# Altium schematic sheet Differential Pair Setup.SchDoc
size 431 x 279 mm; Organization: ORGANIZATION; Address1: ADDRESS 1; Address2: ADDRESS 2; Address3: ADDRESS 3; Address4: ADDRESS 4; Revision: -; SheetNumber: 1; SheetTotal: 1; ENG_APP_DATE: --/--/--; DSN_APP_DATE: --/--/--; CHK_APP_DATE: --/--/--
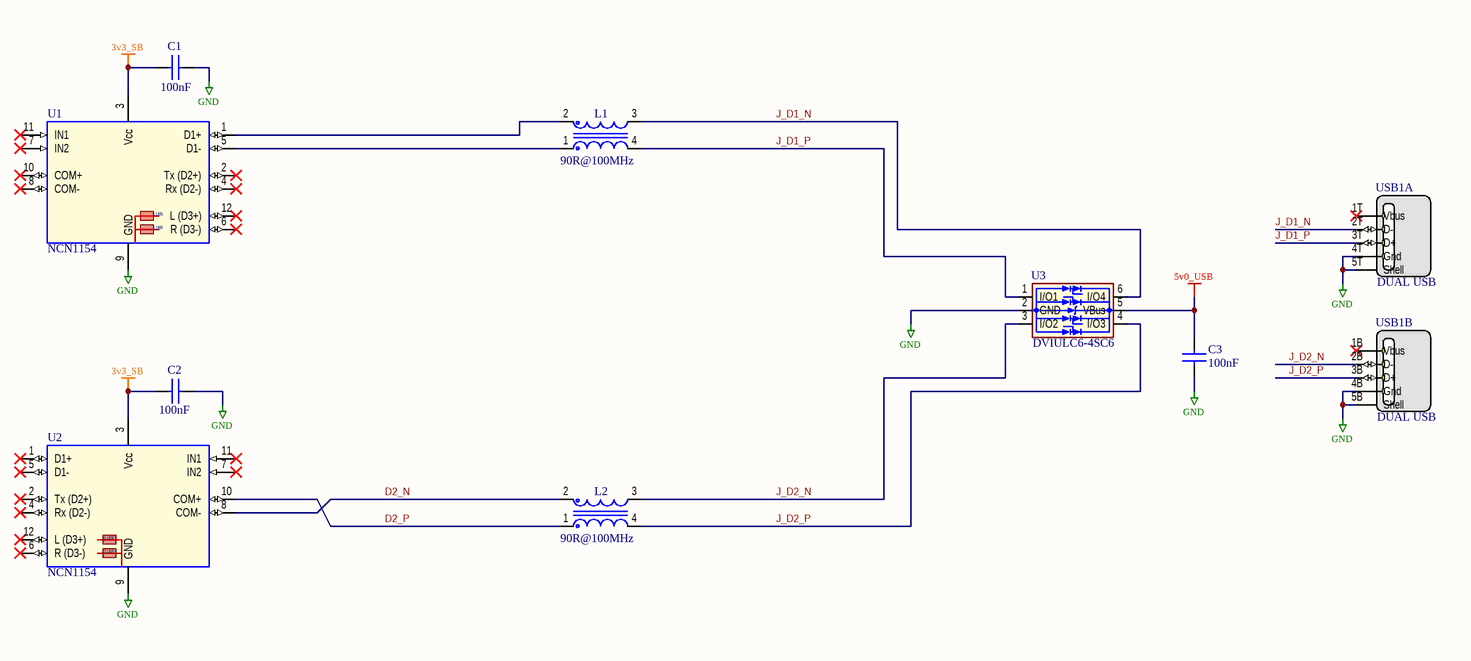
[diagram p0: Differential Pair Setup.SchDoc]

## Parts
C1  100nF  [CC0402]
C2  100nF  [CC0402]
C3  100nF  [CC0402]
L1  90R@100MHz  [ACM2012]
L2  90R@100MHz  [ACM2012]
U1  NCN1154  [UQFN12]
U2  NCN1154  [UQFN12]
U3  DVIULC6-4SC6  [SOT23-6L]
USB1  DUAL USB  [USB-A_RA_DUAL]  (parts A,B of 2)

## Nets
3v3_SB: C1.2 C2.2 U1.3(Vcc) U2.3(Vcc)
5v0_USB: C3.1 U3.5(VBus)
GND: C1.1 C2.1 C3.2 U1.9(GND) U2.9(GND) U3.2(GND) USB1.4B(Gnd) USB1.4T(Gnd) USB1.5B(Shell) USB1.5T(Shell)
D2_N: L2.2 U2.8(COM-)
D2_P: L2.1 U2.10(COM+)
J_D1_N: L1.3 U3.6(I/O4) USB1.2T(D-)
J_D1_P: L1.4 U3.1(I/O1) USB1.3T(D+)
J_D2_N: L2.3 U3.3(I/O2) USB1.2B(D-)
J_D2_P: L2.4 U3.4(I/O3) USB1.3B(D+)
NetL1_1: L1.1 U1.5(D1-)
NetL1_2: L1.2 U1.1(D1+)

Not connected (* = marked no-connect by the designer): U1 2(Tx_(D2+))* 4(Rx_(D2-))* 6(R_(D3-))* 7(IN2)* 8(COM-)* 10(COM+)* 11(IN1)* 12(L_(D3+))*; U2 1(D1+)* 2(Tx_(D2+))* 4(Rx_(D2-))* 5(D1-)* 6(R_(D3-))* 7(IN2)* 11(IN1)* 12(L_(D3+))*; USB1 1B(Vbus)* 1T(Vbus)*

## Notes on the sheet
- 8
- 7
- 6
- 5
- 4
- 3
- DWG. NO.
- REV.
- SHT.
- 2
- 1
- THIS DOCUMENT AND THE DATA DISCLOSED HEREIN OR HEREWITH IS THE PROPERTY OF ALTIUM LIMITED AND MAY BE FREELY DISTRIBUTED IN WHOLE. NO RIGHTS ARE RESERVED OR EXPRESS OR IMPLIED WARANTEE GIVEN.
- REVISION
- DESCRIPTION
- DATE
- APPROVED
- F
- E
- D
- C
- B
- ENG:
- APPROVALS
- PROJECT
- A
- DSN:
- CHK:
- REFERENCE DOCUMENTS
- PROJECT REVISION:
- TITLE
- DOCUMENT REVISION:
- DESIGN ITEM:
- BOM:
- FAB DWG:
- PCB DWG:
- ASSY DWG:
- SCALE:
- SIZE
- CAGE CODE
- FILE NAME
- DWG NO.
- SHEET
- OF
- REV
- (in symbol USB_UART) 118R

## Library data of the parts
C1-C3 = CAP_100nF: Cap, 100nF, X7R, 16V, ±10%, CC0402; Value: 100nF
L1 L2 = FILTER: CMNCK, 90R@100MHz, 50V, 400mA, ACM2012; Value: 90R@100MHz
U1 U2 = USB_UART: 3:1 High-Speed USB /UART/Auido Mux; Value: NCN1154
U3 = ESD_Protector: 4-chl Ultra-Low Capacitance ESD protector with TVS diode; Value: DVIULC6-4SC6
USB1 = USB: RoHS compliant or Toby - KUSB-AS2N-WHT or Toby - KUSB-AS2N-BLK or 2EUK - UBAR-08S or 2EUK (Oupiin) - 8968-A08CRW; Value: DUAL USB